# Altium schematic sheet HashUnit2.SchDoc: ANT_Miner_V1.3
size A2; Date: 2013/11/20; DrawnBy: Bitmain Technology; SheetNumber: 7; SheetTotal: 9
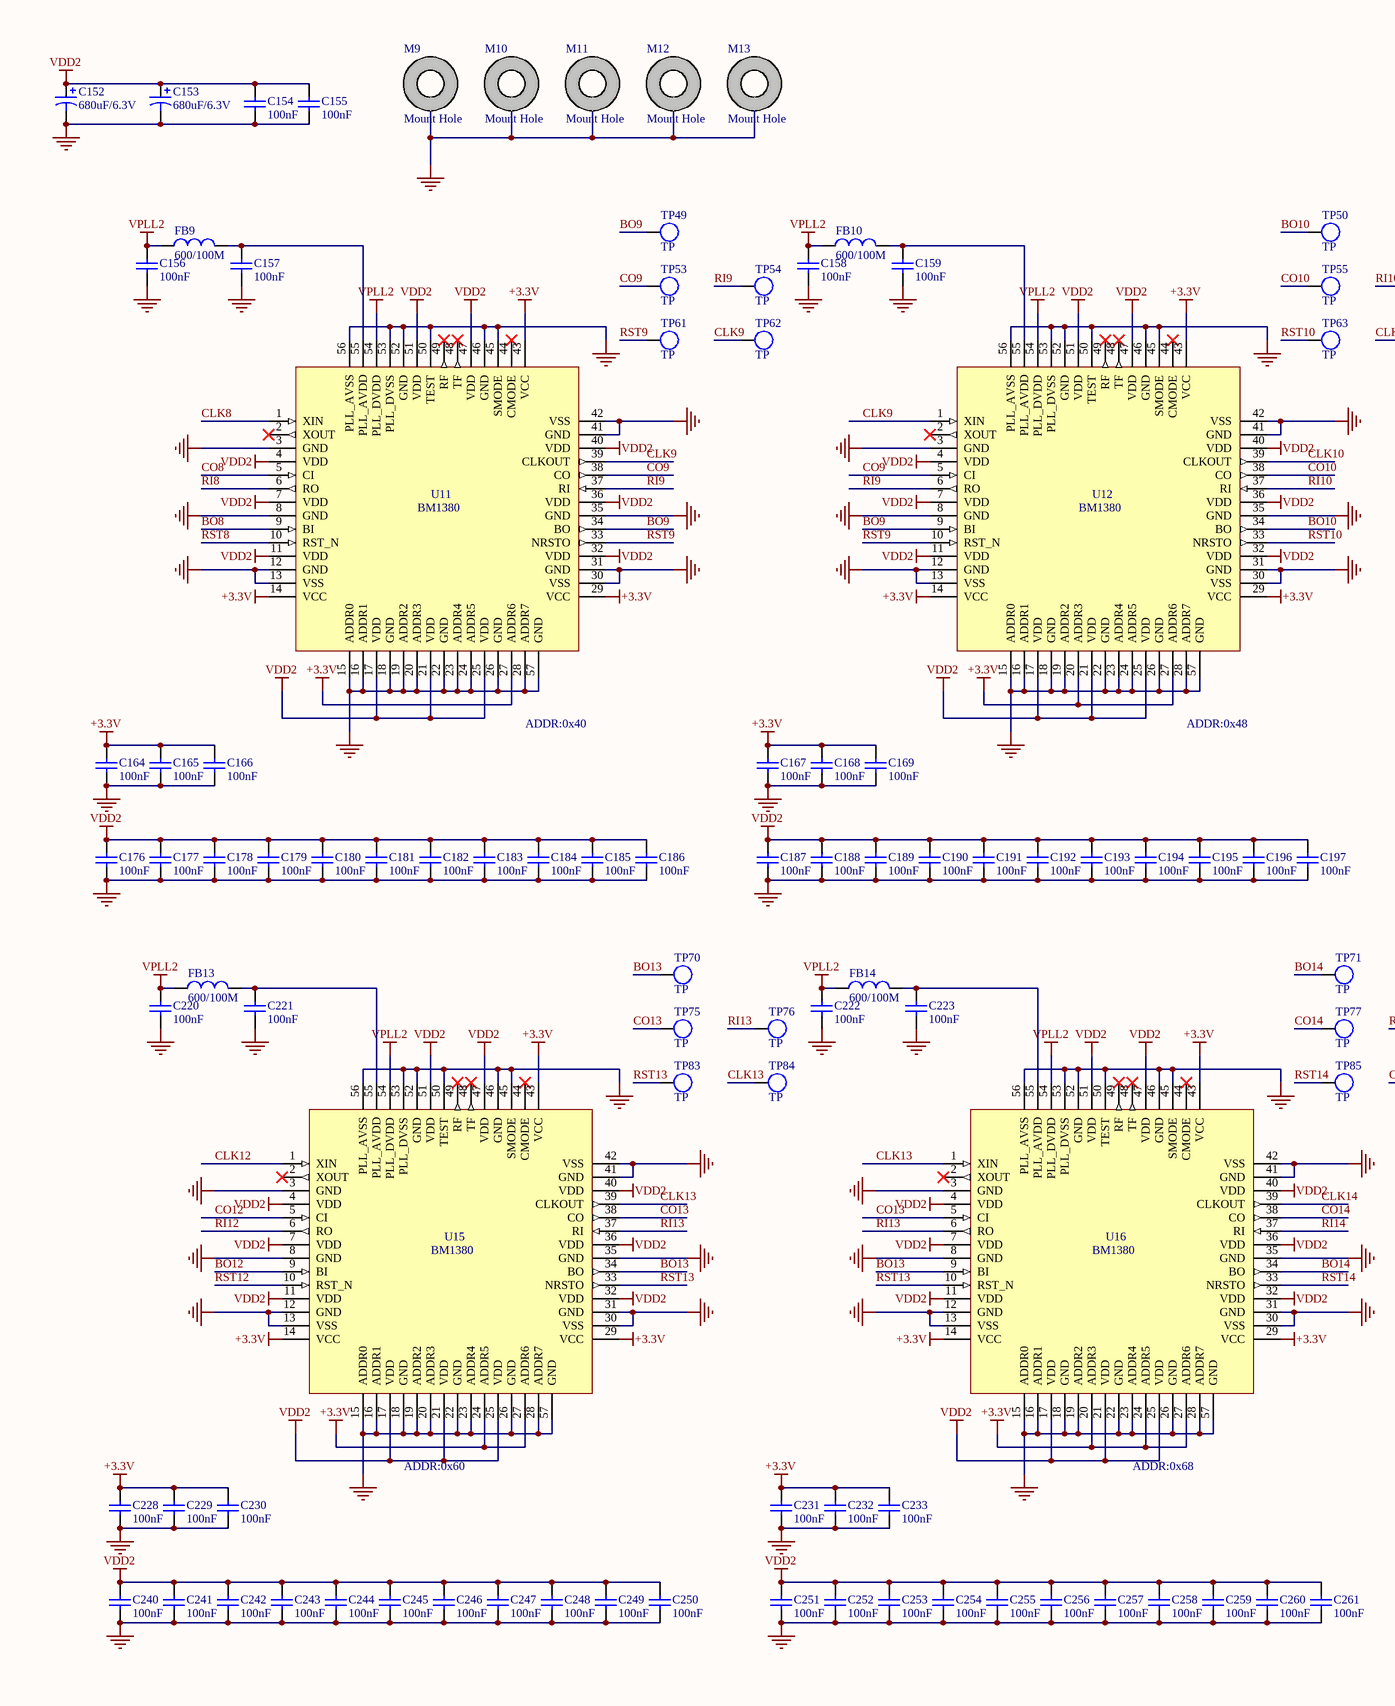
[diagram p0: HashUnit2.SchDoc, left]
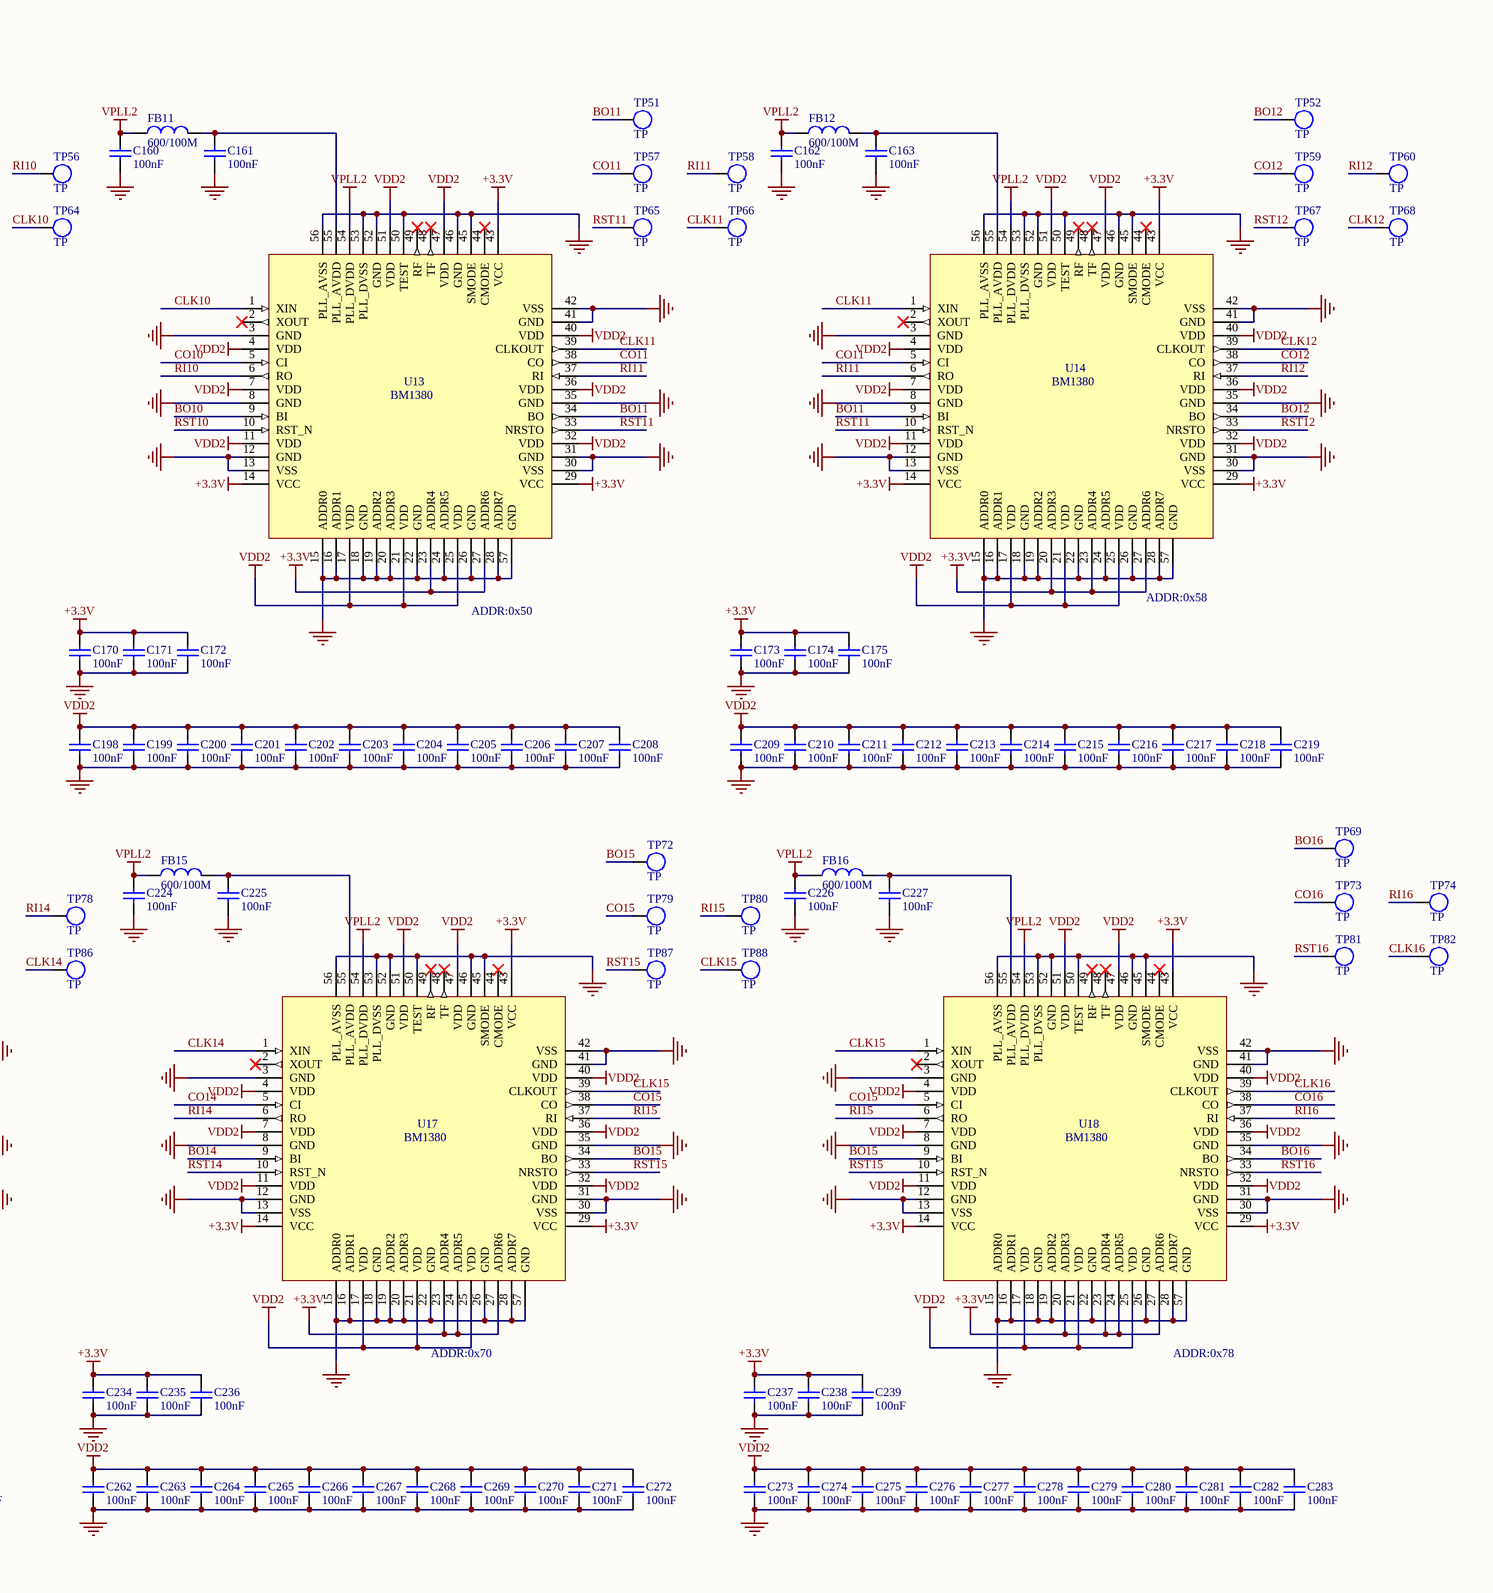
[diagram p1: HashUnit2.SchDoc, right]

## Parts
C152  680uF/6.3V  [D]
C153  680uF/6.3V  [D]
C154  100nF  [CC0603(1608)]
C155  100nF  [CC0603(1608)]
C156  100nF  [CC0603(1608)]
C157  100nF  [CC0603(1608)]
C158  100nF  [CC0603(1608)]
C159  100nF  [CC0603(1608)]
C160  100nF  [CC0603(1608)]
C161  100nF  [CC0603(1608)]
C162  100nF  [CC0603(1608)]
C163  100nF  [CC0603(1608)]
C164  100nF  [CC0603(1608)]
C165  100nF  [CC0603(1608)]
C166  100nF  [CC0603(1608)]
C167  100nF  [CC0603(1608)]
C168  100nF  [CC0603(1608)]
C169  100nF  [CC0603(1608)]
C170  100nF  [CC0603(1608)]
C171  100nF  [CC0603(1608)]
C172  100nF  [CC0603(1608)]
C173  100nF  [CC0603(1608)]
C174  100nF  [CC0603(1608)]
C175  100nF  [CC0603(1608)]
C176  100nF  [CC0603(1608)]
C177  100nF  [CC0603(1608)]
C178  100nF  [CC0603(1608)]
C179  100nF  [CC0603(1608)]
C180  100nF  [CC0603(1608)]
C181  100nF  [CC0603(1608)]
C182  100nF  [CC0603(1608)]
C183  100nF  [CC0603(1608)]
C184  100nF  [CC0603(1608)]
C185  100nF  [CC0603(1608)]
C186  100nF  [CC0603(1608)]
C187  100nF  [CC0603(1608)]
C188  100nF  [CC0603(1608)]
C189  100nF  [CC0603(1608)]
C190  100nF  [CC0603(1608)]
C191  100nF  [CC0603(1608)]
C192  100nF  [CC0603(1608)]
C193  100nF  [CC0603(1608)]
C194  100nF  [CC0603(1608)]
C195  100nF  [CC0603(1608)]
C196  100nF  [CC0603(1608)]
C197  100nF  [CC0603(1608)]
C198  100nF  [CC0603(1608)]
C199  100nF  [CC0603(1608)]
C200  100nF  [CC0603(1608)]
C201  100nF  [CC0603(1608)]
C202  100nF  [CC0603(1608)]
C203  100nF  [CC0603(1608)]
C204  100nF  [CC0603(1608)]
C205  100nF  [CC0603(1608)]
C206  100nF  [CC0603(1608)]
C207  100nF  [CC0603(1608)]
C208  100nF  [CC0603(1608)]
C209  100nF  [CC0603(1608)]
C210  100nF  [CC0603(1608)]
C211  100nF  [CC0603(1608)]
C212  100nF  [CC0603(1608)]
C213  100nF  [CC0603(1608)]
C214  100nF  [CC0603(1608)]
C215  100nF  [CC0603(1608)]
C216  100nF  [CC0603(1608)]
C217  100nF  [CC0603(1608)]
C218  100nF  [CC0603(1608)]
C219  100nF  [CC0603(1608)]
C220  100nF  [CC0603(1608)]
C221  100nF  [CC0603(1608)]
C222  100nF  [CC0603(1608)]
C223  100nF  [CC0603(1608)]
C224  100nF  [CC0603(1608)]
C225  100nF  [CC0603(1608)]
C226  100nF  [CC0603(1608)]
C227  100nF  [CC0603(1608)]
C228  100nF  [CC0603(1608)]
C229  100nF  [CC0603(1608)]
C230  100nF  [CC0603(1608)]
C231  100nF  [CC0603(1608)]
C232  100nF  [CC0603(1608)]
C233  100nF  [CC0603(1608)]
C234  100nF  [CC0603(1608)]
C235  100nF  [CC0603(1608)]
C236  100nF  [CC0603(1608)]
C237  100nF  [CC0603(1608)]
C238  100nF  [CC0603(1608)]
C239  100nF  [CC0603(1608)]
C240  100nF  [CC0603(1608)]
C241  100nF  [CC0603(1608)]
C242  100nF  [CC0603(1608)]
C243  100nF  [CC0603(1608)]
C244  100nF  [CC0603(1608)]
C245  100nF  [CC0603(1608)]
C246  100nF  [CC0603(1608)]
C247  100nF  [CC0603(1608)]
C248  100nF  [CC0603(1608)]
C249  100nF  [CC0603(1608)]
C250  100nF  [CC0603(1608)]
C251  100nF  [CC0603(1608)]
C252  100nF  [CC0603(1608)]
C253  100nF  [CC0603(1608)]
C254  100nF  [CC0603(1608)]
C255  100nF  [CC0603(1608)]
C256  100nF  [CC0603(1608)]
C257  100nF  [CC0603(1608)]
C258  100nF  [CC0603(1608)]
C259  100nF  [CC0603(1608)]
C260  100nF  [CC0603(1608)]
C261  100nF  [CC0603(1608)]
C262  100nF  [CC0603(1608)]
C263  100nF  [CC0603(1608)]
C264  100nF  [CC0603(1608)]
C265  100nF  [CC0603(1608)]
C266  100nF  [CC0603(1608)]
C267  100nF  [CC0603(1608)]
C268  100nF  [CC0603(1608)]
C269  100nF  [CC0603(1608)]
C270  100nF  [CC0603(1608)]
C271  100nF  [CC0603(1608)]
C272  100nF  [CC0603(1608)]
C273  100nF  [CC0603(1608)]
C274  100nF  [CC0603(1608)]
C275  100nF  [CC0603(1608)]
C276  100nF  [CC0603(1608)]
C277  100nF  [CC0603(1608)]
C278  100nF  [CC0603(1608)]
C279  100nF  [CC0603(1608)]
C280  100nF  [CC0603(1608)]
C281  100nF  [CC0603(1608)]
C282  100nF  [CC0603(1608)]
C283  100nF  [CC0603(1608)]
FB9  600/100M  [FB0603(1608)]
FB10  600/100M  [FB0603(1608)]
FB11  600/100M  [FB0603(1608)]
FB12  600/100M  [FB0603(1608)]
FB13  600/100M  [FB0603(1608)]
FB14  600/100M  [FB0603(1608)]
FB15  600/100M  [FB0603(1608)]
FB16  600/100M  [FB0603(1608)]
M9  Mount Hole  [MHOLE2]
M10  Mount Hole  [MHOLE2]
M11  Mount Hole  [MHOLE2]
M12  Mount Hole  [MHOLE2]
M13  Mount Hole  [MHOLE2]
TP49  TP  [TP_SMD]
TP50  TP  [TP_SMD]
TP51  TP  [TP_SMD]
TP52  TP  [TP_SMD]
TP53  TP  [TP_SMD]
TP54  TP  [TP_SMD]
TP55  TP  [TP_SMD]
TP56  TP  [TP_SMD]
TP57  TP  [TP_SMD]
TP58  TP  [TP_SMD]
TP59  TP  [TP_SMD]
TP60  TP  [TP_SMD]
TP61  TP  [TP_SMD]
TP62  TP  [TP_SMD]
TP63  TP  [TP_SMD]
TP64  TP  [TP_SMD]
TP65  TP  [TP_SMD]
TP66  TP  [TP_SMD]
TP67  TP  [TP_SMD]
TP68  TP  [TP_SMD]
TP69  TP  [TP_SMD]
TP70  TP  [TP_SMD]
TP71  TP  [TP_SMD]
TP72  TP  [TP_SMD]
TP73  TP  [TP_SMD]
TP74  TP  [TP_SMD]
TP75  TP  [TP_SMD]
TP76  TP  [TP_SMD]
TP77  TP  [TP_SMD]
TP78  TP  [TP_SMD]
TP79  TP  [TP_SMD]
TP80  TP  [TP_SMD]
TP81  TP  [TP_SMD]
TP82  TP  [TP_SMD]
TP83  TP  [TP_SMD]
TP84  TP  [TP_SMD]
TP85  TP  [TP_SMD]
TP86  TP  [TP_SMD]
TP87  TP  [TP_SMD]
TP88  TP  [TP_SMD]
U11  BM1380  [QFN56]
U12  BM1380  [QFN56]
U13  BM1380  [QFN56]
U14  BM1380  [QFN56]
U15  BM1380  [QFN56]
U16  BM1380  [QFN56]
U17  BM1380  [QFN56]
U18  BM1380  [QFN56]

## Nets
+3.3V: C164.2 C165.2 C166.2 C167.2 C168.2 C169.2 C170.2 C171.2 C172.2 C173.2 C174.2 C175.2 C228.2 C229.2 C230.2 C231.2 C232.2 C233.2 C234.2 C235.2 C236.2 C237.2 C238.2 C239.2 U11.14(VCC) U11.27(ADDR6) U11.29(VCC) U11.43(VCC) U12.14(VCC) U12.20(ADDR3) U12.27(ADDR6) U12.29(VCC) U12.43(VCC) U13.14(VCC) U13.23(ADDR4) U13.27(ADDR6) U13.29(VCC) U13.43(VCC) U14.14(VCC) U14.20(ADDR3) U14.23(ADDR4) U14.27(ADDR6) U14.29(VCC) U14.43(VCC) U15.14(VCC) U15.24(ADDR5) U15.27(ADDR6) U15.29(VCC) U15.43(VCC) U16.14(VCC) U16.20(ADDR3) U16.24(ADDR5) U16.27(ADDR6) U16.29(VCC) U16.43(VCC) U17.14(VCC) U17.23(ADDR4) U17.24(ADDR5) U17.27(ADDR6) U17.29(VCC) U17.43(VCC) U18.14(VCC) U18.20(ADDR3) U18.23(ADDR4) U18.24(ADDR5) U18.27(ADDR6) U18.29(VCC) U18.43(VCC)
GND: C152.2 C153.2 C154.1 C155.1 C156.2 C157.1 C158.2 C159.1 C160.2 C161.1 C162.2 C163.1 C164.1 C165.1 C166.1 C167.1 C168.1 C169.1 C170.1 C171.1 C172.1 C173.1 C174.1 C175.1 C176.1 C177.1 C178.1 C179.1 C180.1 C181.1 C182.1 C183.1 C184.1 C185.1 C186.1 C187.1 C188.1 C189.1 C190.1 C191.1 C192.1 C193.1 C194.1 C195.1 C196.1 C197.1 C198.1 C199.1 C200.1 C201.1 C202.1 C203.1 C204.1 C205.1 C206.1 C207.1 C208.1 C209.1 C210.1 C211.1 C212.1 C213.1 C214.1 C215.1 C216.1 C217.1 C218.1 C219.1 C220.2 C221.1 C222.2 C223.1 C224.2 C225.1 C226.2 C227.1 C228.1 C229.1 C230.1 C231.1 C232.1 C233.1 C234.1 C235.1 C236.1 C237.1 C238.1 C239.1 C240.1 C241.1 C242.1 C243.1 C244.1 C245.1 C246.1 C247.1 C248.1 C249.1 C250.1 C251.1 C252.1 C253.1 C254.1 C255.1 C256.1 C257.1 C258.1 C259.1 C260.1 C261.1 C262.1 C263.1 C264.1 C265.1 C266.1 C267.1 C268.1 C269.1 C270.1 C271.1 C272.1 C273.1 C274.1 C275.1 C276.1 C277.1 C278.1 C279.1 C280.1 C281.1 C282.1 C283.1 M9.0(PIN) M10.0(PIN) M11.0(PIN) M12.0(PIN) M13.0(PIN) U11.3(GND) U11.8(GND) U11.12(GND) U11.13(VSS) U11.15(ADDR0) U11.16(ADDR1) U11.18(GND) U11.19(ADDR2) U11.20(ADDR3) U11.22(GND) U11.23(ADDR4) U11.24(ADDR5) U11.26(GND) U11.28(ADDR7) U11.30(VSS) U11.31(GND) U11.35(GND) U11.41(GND) U11.42(VSS) U11.45(SMODE) U11.46(GND) U11.50(TEST) U11.52(GND) U11.53(PLL_DVSS) U11.56(PLL_AVSS) U11.57(GND) U12.3(GND) U12.8(GND) U12.12(GND) U12.13(VSS) U12.15(ADDR0) U12.16(ADDR1) U12.18(GND) U12.19(ADDR2) U12.22(GND) U12.23(ADDR4) U12.24(ADDR5) U12.26(GND) U12.28(ADDR7) U12.30(VSS) U12.31(GND) U12.35(GND) U12.41(GND) U12.42(VSS) U12.45(SMODE) U12.46(GND) U12.50(TEST) U12.52(GND) U12.53(PLL_DVSS) U12.56(PLL_AVSS) U12.57(GND) U13.3(GND) U13.8(GND) U13.12(GND) U13.13(VSS) U13.15(ADDR0) U13.16(ADDR1) U13.18(GND) U13.19(ADDR2) U13.20(ADDR3) U13.22(GND) U13.24(ADDR5) U13.26(GND) U13.28(ADDR7) U13.30(VSS) U13.31(GND) U13.35(GND) U13.41(GND) U13.42(VSS) U13.45(SMODE) U13.46(GND) U13.50(TEST) U13.52(GND) U13.53(PLL_DVSS) U13.56(PLL_AVSS) U13.57(GND) U14.3(GND) U14.8(GND) U14.12(GND) U14.13(VSS) U14.15(ADDR0) U14.16(ADDR1) U14.18(GND) U14.19(ADDR2) U14.22(GND) U14.24(ADDR5) U14.26(GND) U14.28(ADDR7) U14.30(VSS) U14.31(GND) U14.35(GND) U14.41(GND) U14.42(VSS) U14.45(SMODE) U14.46(GND) U14.50(TEST) U14.52(GND) U14.53(PLL_DVSS) U14.56(PLL_AVSS) U14.57(GND) U15.3(GND) U15.8(GND) U15.12(GND) U15.13(VSS) U15.15(ADDR0) U15.16(ADDR1) U15.18(GND) U15.19(ADDR2) U15.20(ADDR3) U15.22(GND) U15.23(ADDR4) U15.26(GND) U15.28(ADDR7) U15.30(VSS) U15.31(GND) U15.35(GND) U15.41(GND) U15.42(VSS) U15.45(SMODE) U15.46(GND) U15.50(TEST) U15.52(GND) U15.53(PLL_DVSS) U15.56(PLL_AVSS) U15.57(GND) U16.3(GND) U16.8(GND) U16.12(GND) U16.13(VSS) U16.15(ADDR0) U16.16(ADDR1) U16.18(GND) U16.19(ADDR2) U16.22(GND) U16.23(ADDR4) U16.26(GND) U16.28(ADDR7) U16.30(VSS) U16.31(GND) U16.35(GND) U16.41(GND) U16.42(VSS) U16.45(SMODE) U16.46(GND) U16.50(TEST) U16.52(GND) U16.53(PLL_DVSS) U16.56(PLL_AVSS) U16.57(GND) U17.3(GND) U17.8(GND) U17.12(GND) U17.13(VSS) U17.15(ADDR0) U17.16(ADDR1) U17.18(GND) U17.19(ADDR2) U17.20(ADDR3) U17.22(GND) U17.26(GND) U17.28(ADDR7) U17.30(VSS) U17.31(GND) U17.35(GND) U17.41(GND) U17.42(VSS) U17.45(SMODE) U17.46(GND) U17.50(TEST) U17.52(GND) U17.53(PLL_DVSS) U17.56(PLL_AVSS) U17.57(GND) U18.3(GND) U18.8(GND) U18.12(GND) U18.13(VSS) U18.15(ADDR0) U18.16(ADDR1) U18.18(GND) U18.19(ADDR2) U18.22(GND) U18.26(GND) U18.28(ADDR7) U18.30(VSS) U18.31(GND) U18.35(GND) U18.41(GND) U18.42(VSS) U18.45(SMODE) U18.46(GND) U18.50(TEST) U18.52(GND) U18.53(PLL_DVSS) U18.56(PLL_AVSS) U18.57(GND)
VDD2: C152.1 C153.1 C154.2 C155.2 C176.2 C177.2 C178.2 C179.2 C180.2 C181.2 C182.2 C183.2 C184.2 C185.2 C186.2 C187.2 C188.2 C189.2 C190.2 C191.2 C192.2 C193.2 C194.2 C195.2 C196.2 C197.2 C198.2 C199.2 C200.2 C201.2 C202.2 C203.2 C204.2 C205.2 C206.2 C207.2 C208.2 C209.2 C210.2 C211.2 C212.2 C213.2 C214.2 C215.2 C216.2 C217.2 C218.2 C219.2 C240.2 C241.2 C242.2 C243.2 C244.2 C245.2 C246.2 C247.2 C248.2 C249.2 C250.2 C251.2 C252.2 C253.2 C254.2 C255.2 C256.2 C257.2 C258.2 C259.2 C260.2 C261.2 C262.2 C263.2 C264.2 C265.2 C266.2 C267.2 C268.2 C269.2 C270.2 C271.2 C272.2 C273.2 C274.2 C275.2 C276.2 C277.2 C278.2 C279.2 C280.2 C281.2 C282.2 C283.2 U11.4(VDD) U11.7(VDD) U11.11(VDD) U11.17(VDD) U11.21(VDD) U11.25(VDD) U11.32(VDD) U11.36(VDD) U11.40(VDD) U11.47(VDD) U11.51(VDD) U12.4(VDD) U12.7(VDD) U12.11(VDD) U12.17(VDD) U12.21(VDD) U12.25(VDD) U12.32(VDD) U12.36(VDD) U12.40(VDD) U12.47(VDD) U12.51(VDD) U13.4(VDD) U13.7(VDD) U13.11(VDD) U13.17(VDD) U13.21(VDD) U13.25(VDD) U13.32(VDD) U13.36(VDD) U13.40(VDD) U13.47(VDD) U13.51(VDD) U14.4(VDD) U14.7(VDD) U14.11(VDD) U14.17(VDD) U14.21(VDD) U14.25(VDD) U14.32(VDD) U14.36(VDD) U14.40(VDD) U14.47(VDD) U14.51(VDD) U15.4(VDD) U15.7(VDD) U15.11(VDD) U15.17(VDD) U15.21(VDD) U15.25(VDD) U15.32(VDD) U15.36(VDD) U15.40(VDD) U15.47(VDD) U15.51(VDD) U16.4(VDD) U16.7(VDD) U16.11(VDD) U16.17(VDD) U16.21(VDD) U16.25(VDD) U16.32(VDD) U16.36(VDD) U16.40(VDD) U16.47(VDD) U16.51(VDD) U17.4(VDD) U17.7(VDD) U17.11(VDD) U17.17(VDD) U17.21(VDD) U17.25(VDD) U17.32(VDD) U17.36(VDD) U17.40(VDD) U17.47(VDD) U17.51(VDD) U18.4(VDD) U18.7(VDD) U18.11(VDD) U18.17(VDD) U18.21(VDD) U18.25(VDD) U18.32(VDD) U18.36(VDD) U18.40(VDD) U18.47(VDD) U18.51(VDD)
VPLL2: C156.1 C158.1 C160.1 C162.1 C220.1 C222.1 C224.1 C226.1 FB9.2 FB10.2 FB11.2 FB12.2 FB13.2 FB14.2 FB15.2 FB16.2 U11.54(PLL_DVDD) U12.54(PLL_DVDD) U13.54(PLL_DVDD) U14.54(PLL_DVDD) U15.54(PLL_DVDD) U16.54(PLL_DVDD) U17.54(PLL_DVDD) U18.54(PLL_DVDD)
BO8: U11.9(BI)
BO9: TP49.1 U11.34(BO) U12.9(BI)
BO10: TP50.1 U12.34(BO) U13.9(BI)
BO11: TP51.1 U13.34(BO) U14.9(BI)
BO12: TP52.1 U14.34(BO) U15.9(BI)
BO13: TP70.1 U15.34(BO) U16.9(BI)
BO14: TP71.1 U16.34(BO) U17.9(BI)
BO15: TP72.1 U17.34(BO) U18.9(BI)
BO16: TP69.1 U18.34(BO)
CLK8: U11.1(XIN)
CLK9: TP62.1 U11.39(CLKOUT) U12.1(XIN)
CLK10: TP64.1 U12.39(CLKOUT) U13.1(XIN)
CLK11: TP66.1 U13.39(CLKOUT) U14.1(XIN)
CLK12: TP68.1 U14.39(CLKOUT) U15.1(XIN)
CLK13: TP84.1 U15.39(CLKOUT) U16.1(XIN)
CLK14: TP86.1 U16.39(CLKOUT) U17.1(XIN)
CLK15: TP88.1 U17.39(CLKOUT) U18.1(XIN)
CLK16: TP82.1 U18.39(CLKOUT)
CO8: U11.5(CI)
CO9: TP53.1 U11.38(CO) U12.5(CI)
CO10: TP55.1 U12.38(CO) U13.5(CI)
CO11: TP57.1 U13.38(CO) U14.5(CI)
CO12: TP59.1 U14.38(CO) U15.5(CI)
CO13: TP75.1 U15.38(CO) U16.5(CI)
CO14: TP77.1 U16.38(CO) U17.5(CI)
CO15: TP79.1 U17.38(CO) U18.5(CI)
CO16: TP73.1 U18.38(CO)
RI8: U11.6(RO)
RI9: TP54.1 U11.37(RI) U12.6(RO)
RI10: TP56.1 U12.37(RI) U13.6(RO)
RI11: TP58.1 U13.37(RI) U14.6(RO)
RI12: TP60.1 U14.37(RI) U15.6(RO)
RI13: TP76.1 U15.37(RI) U16.6(RO)
RI14: TP78.1 U16.37(RI) U17.6(RO)
RI15: TP80.1 U17.37(RI) U18.6(RO)
RI16: TP74.1 U18.37(RI)
RST8: U11.10(RST_N)
RST9: TP61.1 U11.33(NRSTO) U12.10(RST_N)
RST10: TP63.1 U12.33(NRSTO) U13.10(RST_N)
RST11: TP65.1 U13.33(NRSTO) U14.10(RST_N)
RST12: TP67.1 U14.33(NRSTO) U15.10(RST_N)
RST13: TP83.1 U15.33(NRSTO) U16.10(RST_N)
RST14: TP85.1 U16.33(NRSTO) U17.10(RST_N)
RST15: TP87.1 U17.33(NRSTO) U18.10(RST_N)
RST16: TP81.1 U18.33(NRSTO)
NetC157_2: C157.2 FB9.1 U11.55(PLL_AVDD)
NetC159_2: C159.2 FB10.1 U12.55(PLL_AVDD)
NetC161_2: C161.2 FB11.1 U13.55(PLL_AVDD)
NetC163_2: C163.2 FB12.1 U14.55(PLL_AVDD)
NetC221_2: C221.2 FB13.1 U15.55(PLL_AVDD)
NetC223_2: C223.2 FB14.1 U16.55(PLL_AVDD)
NetC225_2: C225.2 FB15.1 U17.55(PLL_AVDD)
NetC227_2: C227.2 FB16.1 U18.55(PLL_AVDD)

Not connected (* = marked no-connect by the designer): U11 2(XOUT)* 44(CMODE)* 48(TF)* 49(RF)*; U12 2(XOUT)* 44(CMODE)* 48(TF)* 49(RF)*; U13 2(XOUT)* 44(CMODE)* 48(TF)* 49(RF)*; U14 2(XOUT)* 44(CMODE)* 48(TF)* 49(RF)*; U15 2(XOUT)* 44(CMODE)* 48(TF)* 49(RF)*; U16 2(XOUT)* 44(CMODE)* 48(TF)* 49(RF)*; U17 2(XOUT)* 44(CMODE)* 48(TF)* 49(RF)*; U18 2(XOUT)* 44(CMODE)* 48(TF)* 49(RF)*

## Notes on the sheet
- ADDR:0x40
- ADDR:0x48
- ADDR:0x50
- ADDR:0x58
- ADDR:0x60
- ADDR:0x68
- ADDR:0x70
- ADDR:0x78

## Library data of the parts
C152 C153 = T492C: Solid Tantalum Chip Capacitor, T492 Series - CWR11 Style Per Mil-PRF-55365/8; Published: 17-Jul-2002; LatestRevisionDate: 19-Mar-2004; LatestRevisionNote: Silkscreen dimensions re-sized.; DatasheetDocument: Mar-2001; PackageDocument: Mar-2001; PackageReference: C; Publisher: Altium Limited; Code_JEITA: 6032-28; ComponentLink1Description: Manufacturer Link; ComponentLink1URL: http://www.kemet.com/; ComponentLink2Description: Datasheet; ComponentLink2URL: http://www.kemet.com/kemet/web/homepage/kechome.nsf/vapubfilesname/F3102TA.pdf/$file/F3102TA.pdf; Value: 680uF/6.3V
C154 C155 = Cap Semi: Capacitor (Semiconductor SIM Model); Published: 8-Jun-2000; LatestRevisionDate: 29-May-2009; LatestRevisionNote: IPC-7351 Footprint Added.; PackageReference: C1206; Publisher: Altium Limited; PackageDescription: Chip Capacitor; Value: 100nF
C156-C283 = Cap: Capacitor; Published: 8-Jun-2000; LatestRevisionDate: 17-Jul-2002; LatestRevisionNote: Re-released for DXP Platform.; PackageReference: RAD-0.3; Publisher: Altium Limited; PackageDescription: Radial Cap, Thru-Hole; 2 Leads; 0.3 in Pin Spacing; Value: 100nF
FB9-FB16 = FB: Inductor; Code_IEC: 1005; Published: 8-Jun-2000; LatestRevisionDate: 29-May-2009; LatestRevisionNote: IPC-7351 Footprint Added.; PackageReference: 0402-A; Publisher: Altium Limited; PackageDescription: Chip Inductor; Code_JEITA: 0402; Value: 600/100M
M9-M13 = M_Hole
TP49-TP88 = TP: Test Point; Value: TP